# EAGLE design MicroPak-10_Breakout (EAGLE 9.6.2)
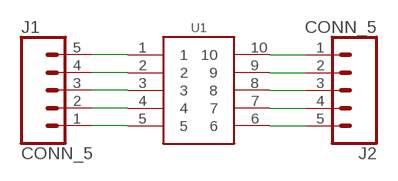
[diagram p0: schematic, sheet 1]

## Parts
J1  CONN_5  [1X05]
J2  CONN_5  [1X05]
U1  GEN_10MICROPACK  [MICROPAK_10]

## Nets
N$1: J1.5 U1.1
N$2: J1.4 U1.2
N$3: J1.3 U1.3
N$4: J1.2 U1.4
N$5: J1.1 U1.5
N$6: J2.5 U1.6
N$7: J2.4 U1.7
N$8: J2.3 U1.8
N$9: J2.2 U1.9
N$10: J2.1 U1.10

## Library data of the parts
J1 J2 = bschulz:CONN_5: Genaric 5 terminal header
U1 = bschulz:GEN_10: Generic 10 Pin Package for Breakout Boards

## Board
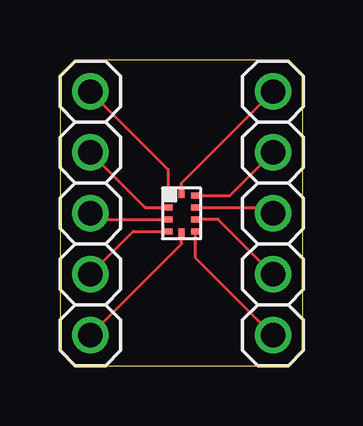
[diagram p1: board, top side]

Size 10.14 x 12.75 mm. Coordinates in mm from the lower left corner, seen from the top.
Outline: 9.51,12.75 0.64,12.75 0,12.12 0,0.64 0.64,0 9.51,0 10.14,0.64 10.14,12.12 9.51,12.75
Copper layers (1*16): Top 0.035559375mm / dielectric 1.6mm / Bottom 0.035559375mm
Design rules "jlcpcb-2layer": minimum track width 5mil, minimum drill 0.2mm, track to track 5mil, track to pad 6mil, pad to pad 5mil, via to via 6mil, smd to smd 5mil, copper to edge 15mil, drill to drill 6mil, minimum pad ring 5mil, minimum via ring 5mil, stop-mask expansion 2.5mil, vias tented up to drill 0mil, thermal gap 10mil

### Footprints (pad centres in the part's own frame; a part is rotated, then mirrored left to right if it is on the bottom)
1X05 = drill 1.016: 1 -5.08,0; 2 -2.54,0; 3 0,0; 4 2.54,0; 5 5.08,0
MICROPAK_10 = smd 0.25 x 0.35: 1 -0.75,-0.56; 2 -0.25,-0.56; 3 0.25,-0.56; 4 0.75,-0.56; 6 0.75,0.56; 7 0.25,0.56; 8 -0.25,0.56; 9 -0.75,0.56 | smd 0.35 x 0.25: 5 0.81,0; 10 -0.81,0

### Placement (x,y rotation side)
J1  1.27,6.35 90 top
J2  8.89,6.35 270 top
U1  5.08,6.35 270 top

### Tracks (layer width: path | path; a pad name or v marks a point on that pad's centre or on a via)
N$1
  Top 0.127: J1.5 4.52,8.18 U1.1
N$2
  Top 0.127: J1.4 3.56,6.6 U1.2
N$3
  Top 0.127: J1.3 1.52,6.1 U1.3
N$4
  Top 0.127: J1.2 3.06,5.6 U1.4
N$5
  Top 0.127: J1.1 5.08,5.08 U1.5
N$6
  Top 0.127: U1.6 5.64,4.52 J2.5
N$7
  Top 0.127: J2.4 6.6,6.1 U1.7
N$8
  Top 0.127: U1.8 8.64,6.6 J2.3
N$9
  Top 0.127: U1.9 7.1,7.1 J2.2
N$10
  Top 0.127: U1.10 5.08,7.62 J2.1

### Text on the board
tDocu: 1 | 10 | MicroPak / 10 | 2 | 9 | 3 | 8 | 4 | 7 | Break44 / B. Schulz | 5 | 6